# Altium schematic sheet Ethernet.SchDoc
size A4; SheetNumber: 4; SheetTotal: 4
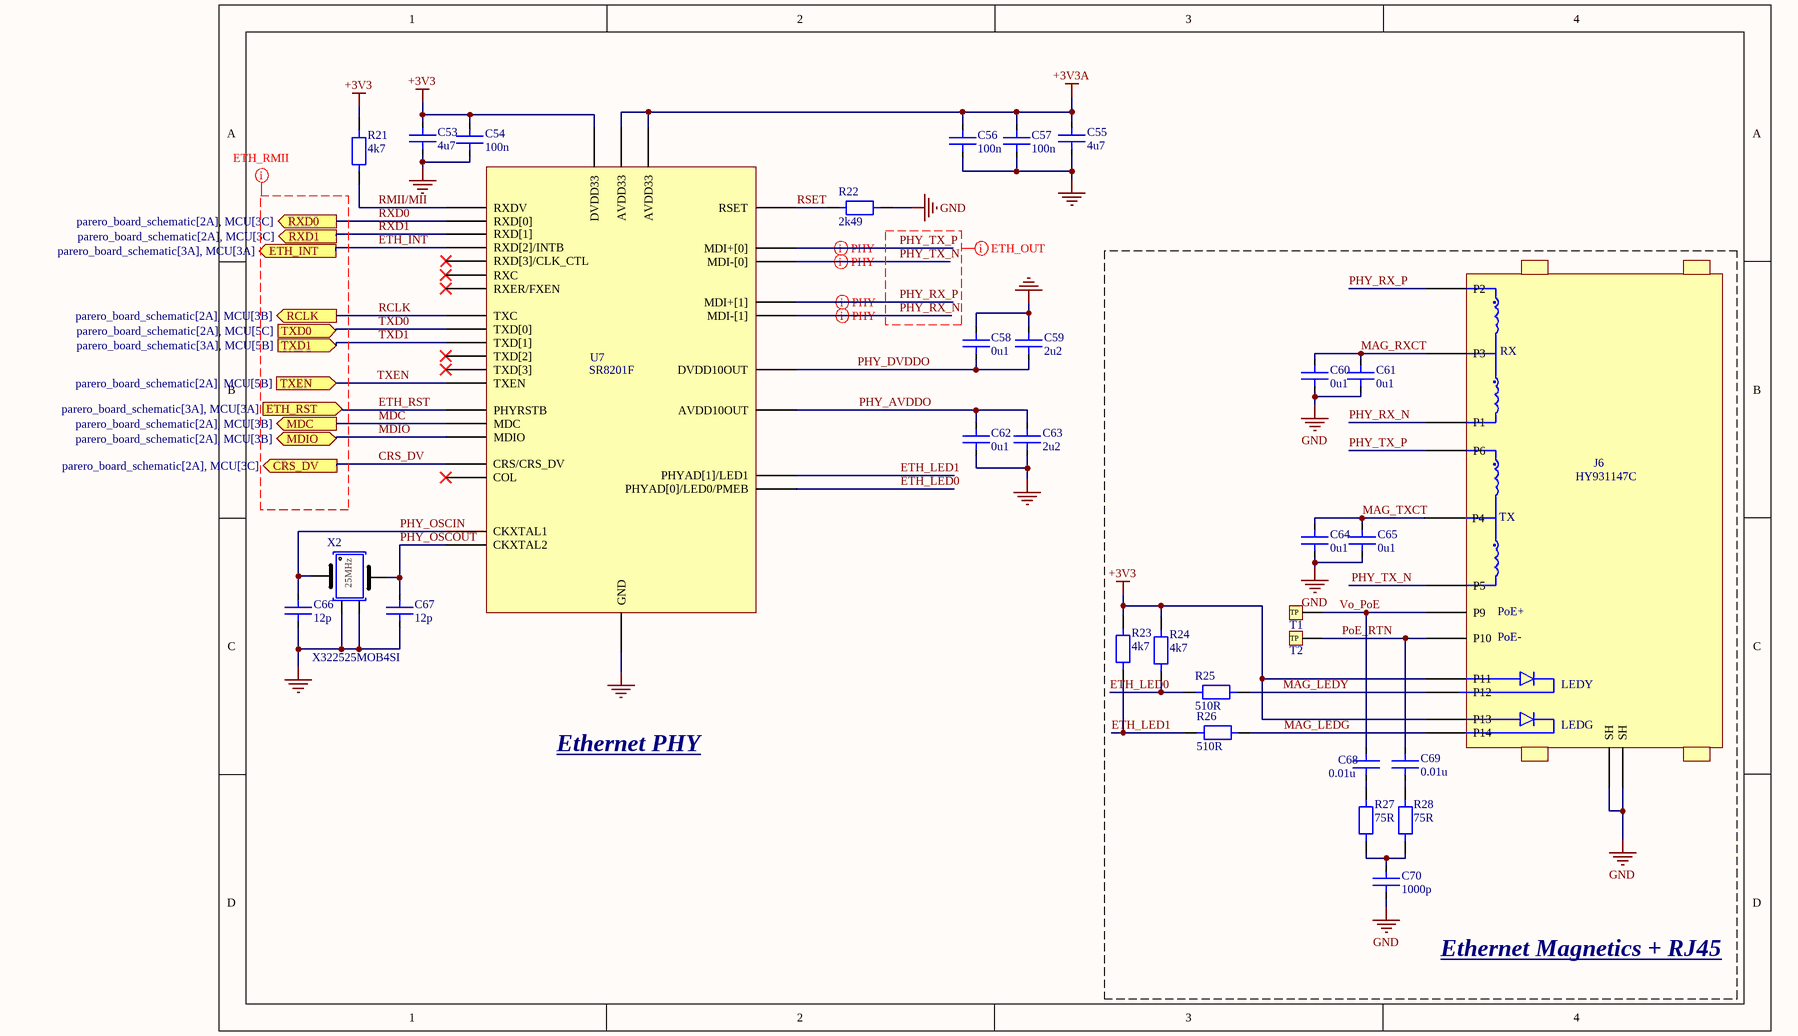
[diagram p0: Ethernet.SchDoc]

## Parts
C53  4u7  [CAP_MLCC_0603]
C54  100n  [CAP_MLCC_0402]
C55  4u7  [CAP_MLCC_0603]
C56  100n  [CAP_MLCC_0402]
C57  100n  [CAP_MLCC_0402]
C58  0u1  [CAP_MLCC_0402]
C59  2u2  [CAP_MLCC_0402]
C60  0u1  [CAP_MLCC_0402]
C61  0u1  [CAP_MLCC_0402]
C62  0u1  [CAP_MLCC_0402]
C63  2u2  [CAP_MLCC_0402]
C64  0u1  [CAP_MLCC_0402]
C65  0u1  [CAP_MLCC_0402]
C66  12p  [CAP_MLCC_0402]
C67  12p  [CAP_MLCC_0402]
C68  0.01u  [CAP_MLCC_0402]
C69  0.01u  [CAP_MLCC_0402]
C70  1000p  [CAP_MLCC_0402]
J6  HY931147C  [CONN_ETH_RJ45]
R21  4k7  [RES_SMD_0402]
R22  2k49  [RES_SMD_0402]
R23  4k7  [RES_SMD_0402]
R24  4k7  [RES_SMD_0402]
R25  510R  [RES_SMD_0402]
R26  510R  [RES_SMD_0402]
R27  75R  [RES_SMD_0402]
R28  75R  [RES_SMD_0402]
T1  TP  [TPAD]  (value not drawn)  (no BOM)
T2  TP  [TPAD]  (value not drawn)  (no BOM)
U7  SR8201F  [SR8201F_QFN32]
X2  X322525MOB4SI  [XTAL_SMD_YXC]

## Blocks framed on the sheet
Ethernet Magnetics + RJ45: C60 C61 C64 C65 C68-C70 J6 R23-R28 T1 T2

## Ports
CRS_DV (out, see parero_board_schematic[2A], MCU[3C]), ETH_INT (out, see parero_board_schematic[3A], MCU[3A]), ETH_RST (in, see parero_board_schematic[3A], MCU[3A]), MDC (out, see parero_board_schematic[2A], MCU[3B]), MDIO (bidir, see parero_board_schematic[2A], MCU[3B]), RCLK (out, see parero_board_schematic[2A], MCU[3B]), RXD0 (out, see parero_board_schematic[2A], MCU[3C]), RXD1 (out, see parero_board_schematic[2A], MCU[3C]), TXD0 (in, see parero_board_schematic[2A], MCU[5C]), TXD1 (in, see parero_board_schematic[3A], MCU[5B]), TXEN (in, see parero_board_schematic[2A], MCU[5B])

## Nets
+3V3: C53.2 C54.2 J6.11(P11) J6.13(P13) R21.2 R23.2 R24.2 U7.14(DVDD33)
+3V3A: C55.2 C56.2 C57.2 U7.7(AVDD33) U7.30(AVDD33)
GND: C53.1 C54.1 C55.1 C56.1 C57.1 C58.2 C59.2 C60.1 C61.1 C62.1 C63.1 C64.1 C65.1 C66.1 C67.1 C70.1 J6.15(SH) J6.16(SH) R22.2 U7.33(GND) X2.2 X2.4
CRS_DV: U7.26(CRS/CRS_DV) ; port CRS_DV
ETH_INT: U7.11(RXD[2]/INTB) ; port ETH_INT
ETH_LED0: R24.1 R25.1 U7.24(PHYAD[0]/LED0/PMEB)
ETH_LED1: R23.1 R26.1 U7.25(PHYAD[1]/LED1)
ETH_RST: U7.21(PHYRSTB) ; port ETH_RST
MAG_LEDG: J6.14(P14) R26.2
MAG_LEDY: J6.12(P12) R25.2
MAG_RXCT: C60.2 C61.2 J6.3(P3)
MAG_TXCT: C64.2 C65.2 J6.4(P4)
MDC: U7.22(MDC) ; port MDC
MDIO: U7.23(MDIO) ; port MDIO
PHY_AVDDO: C62.2 C63.2 U7.2(AVDD10OUT)
PHY_DVDDO: C58.1 C59.1 U7.29(DVDD10OUT)
PHY_OSCIN: C66.2 U7.31(CKXTAL1) X2.1
PHY_OSCOUT: C67.2 U7.32(CKXTAL2) X2.3
PHY_RX_N: J6.1(P1) U7.6(MDI-[1])
PHY_RX_P: J6.2(P2) U7.5(MDI+[1])
PHY_TX_N: J6.5(P5) U7.4(MDI-[0])
PHY_TX_P: J6.6(P6) U7.3(MDI+[0])
PoE_RTN: C69.2 J6.10(P10) T2.1(TP)
RCLK: U7.15(TXC) ; port RCLK
RMII/MII: R21.1 U7.8(RXDV)
RSET: R22.1 U7.1(RSET)
RXD0: U7.9(RXD[0]) ; port RXD0
RXD1: U7.10(RXD[1]) ; port RXD1
TXD0: U7.16(TXD[0]) ; port TXD0
TXD1: U7.17(TXD[1]) ; port TXD1
TXEN: U7.20(TXEN) ; port TXEN
Vo_PoE: C68.2 J6.9(P9) T1.1(TP)
NetC68_1: C68.1 R27.2
NetC69_1: C69.1 R28.2
NetC70_2: C70.2 R27.1 R28.1

Not connected (* = marked no-connect by the designer): U7 12(RXD[3]/CLK_CTL)* 13(RXC)* 18(TXD[2])* 19(TXD[3])* 27(COL)* 28(RXER/FXEN)*

## Layout directives
net class ETH_RMII: (no net found under the mark)
net class ETH_OUT: PHY_RX_N, PHY_RX_P, PHY_TX_N, PHY_TX_P
differential pair: PHY_RX_N, PHY_RX_P, PHY_TX_N, PHY_TX_P

## Notes on the sheet
- Ethernet PHY
- (in symbol Connector RJ45 MagJack) RX; TX; PoE+; PoE-; LEDY; LEDG
- (in symbol Crystal SMD 25MHz) 25MHz

## Library data of the parts
C53 C55 = Cap MLCC 0603: Multilayer  Ceramic Capacitor; Manufacturer 1: muRata; Manufacturer Part Number 1: GRM188R60J475KE19D; Designator: C?; Quantity: *
C54 C56-C58 C60-C62 C64 C65 = Cap MLCC 0402: Multilayer  Ceramic Capacitor; Manufacturer 1: Samsung Electro-Mechanics; Manufacturer Part Number 1: CL05B104KO5NNNC; Designator: C?; Quantity: *
C59 C63 = Cap MLCC 0402: Multilayer  Ceramic Capacitor; Manufacturer 1: muRata; Manufacturer Part Number 1: GRM155R61A225KE95D; Designator: C?; Quantity: *
C66 C67 = Cap MLCC 0402: Multilayer  Ceramic Capacitor; Manufacturer 1: muRata; Manufacturer Part Number 1: GRM1555C1H120GA01D; Designator: C?; Quantity: *
C68 C69 = Cap MLCC 0402: Multilayer  Ceramic Capacitor; Manufacturer 1: muRata; Manufacturer Part Number 1: GRM1555C1E103GE01D; Designator: C?; Quantity: *
C70 = Cap MLCC 0402: Multilayer  Ceramic Capacitor; Manufacturer 1: muRata; Manufacturer Part Number 1: GRM1555C1H102JA01D; Designator: C?; Quantity: *
J6 = Connector RJ45 MagJack: 1 With LED Through Hole Modular/Ethernet Connector Jacks With Magnetics RoHS; Manufacturer 1: HANRUN(Zhongshan HanRun Elec); Designator: J?; Manufacturer Part Number 1: HY931147C; Quantity: *; ComponentLink1Description: Product Link; ComponentLink1URL: https://www.lcsc.com/product-detail/C91754.html; ComponentLink2Description: Datasheet; ComponentLink2URL: https://item.szlcsc.com/datasheet/HY931147C/92943.html
R21 R23 R24 = Resistor 0402: General Purpose SMD Carbon Resistor; Manufacturer 1: UNI-ROYAL; Manufacturer Part Number 1: 0402WGF4701TCE; Designator: R?; Quantity: *
R22 = Resistor 0402: General Purpose SMD Carbon Resistor; Manufacturer 1: UNI-ROYAL; Manufacturer Part Number 1: 0402WGF2491TCE; Quantity: *
R25 R26 = Resistor 0402: General Purpose SMD Carbon Resistor; Manufacturer 1: UNI-ROYAL; Manufacturer Part Number 1: 0402WGF5100TCE; Quantity: *
R27 R28 = Resistor 0402: General Purpose SMD Carbon Resistor; Manufacturer 1: UNI-ROYAL; Manufacturer Part Number 1: 0402WGF750JTCE; Designator: R?; Quantity: *
T1 T2 = Tpad: Test Pad
U7 = Interface ETHERNET PHY SR8201F: Single-chip 10/100M Ethernet PHYceiver, supporting Auto MDIX; Manufacturer 1: CoreChips; Designator: U?; Manufacturer Part Number 1: SR8201F; Quantity: *; ComponentLink1Description: Product Link; ComponentLink1URL: https://www.lcsc.com/product-detail/C378491.html; ComponentLink2Description: Datasheet; ComponentLink2URL: https://item.szlcsc.com/datasheet/SR8201F/351626.html
X2 = Crystal SMD 25MHz: Crystal Oscillator 12pF SMD3225-4P Crystals ROHS; Manufacturer 1: YXC Crystal Oscillators; Designator: X?; Manufacturer Part Number 1: X322525MOB4SI; Quantity: *; ComponentLink1Description: Datasheet; ComponentLink1URL: https://item.szlcsc.com/datasheet/X322525MOB4SI/9526.html?lcsc_vid=T1EMVlBfE1BXVVADFQQNUlMFT1RXUAZeFlhfBlAAQVExVlNQR1lZUlNfQVJeUTsOAxUeFF5JWBEcCEoDFhIXAgAHWQIBCks%3D; ComponentLink2Description: Product Link; ComponentLink2URL: https://www.lcsc.com/product-detail/C9006.html